# EasyEDA Pro project ProPrj_VacUBear_2026-03-05.epro

# Schematic Schematic1
Board Name: Board1; Create Date: 2026-03-03; Page Name: P1; Project Name: VacUBear; Schematic Name: Schematic1; Update Date: 2026-03-03; Company: EasyEDA.com; Page Size: A4; Version: V1.0
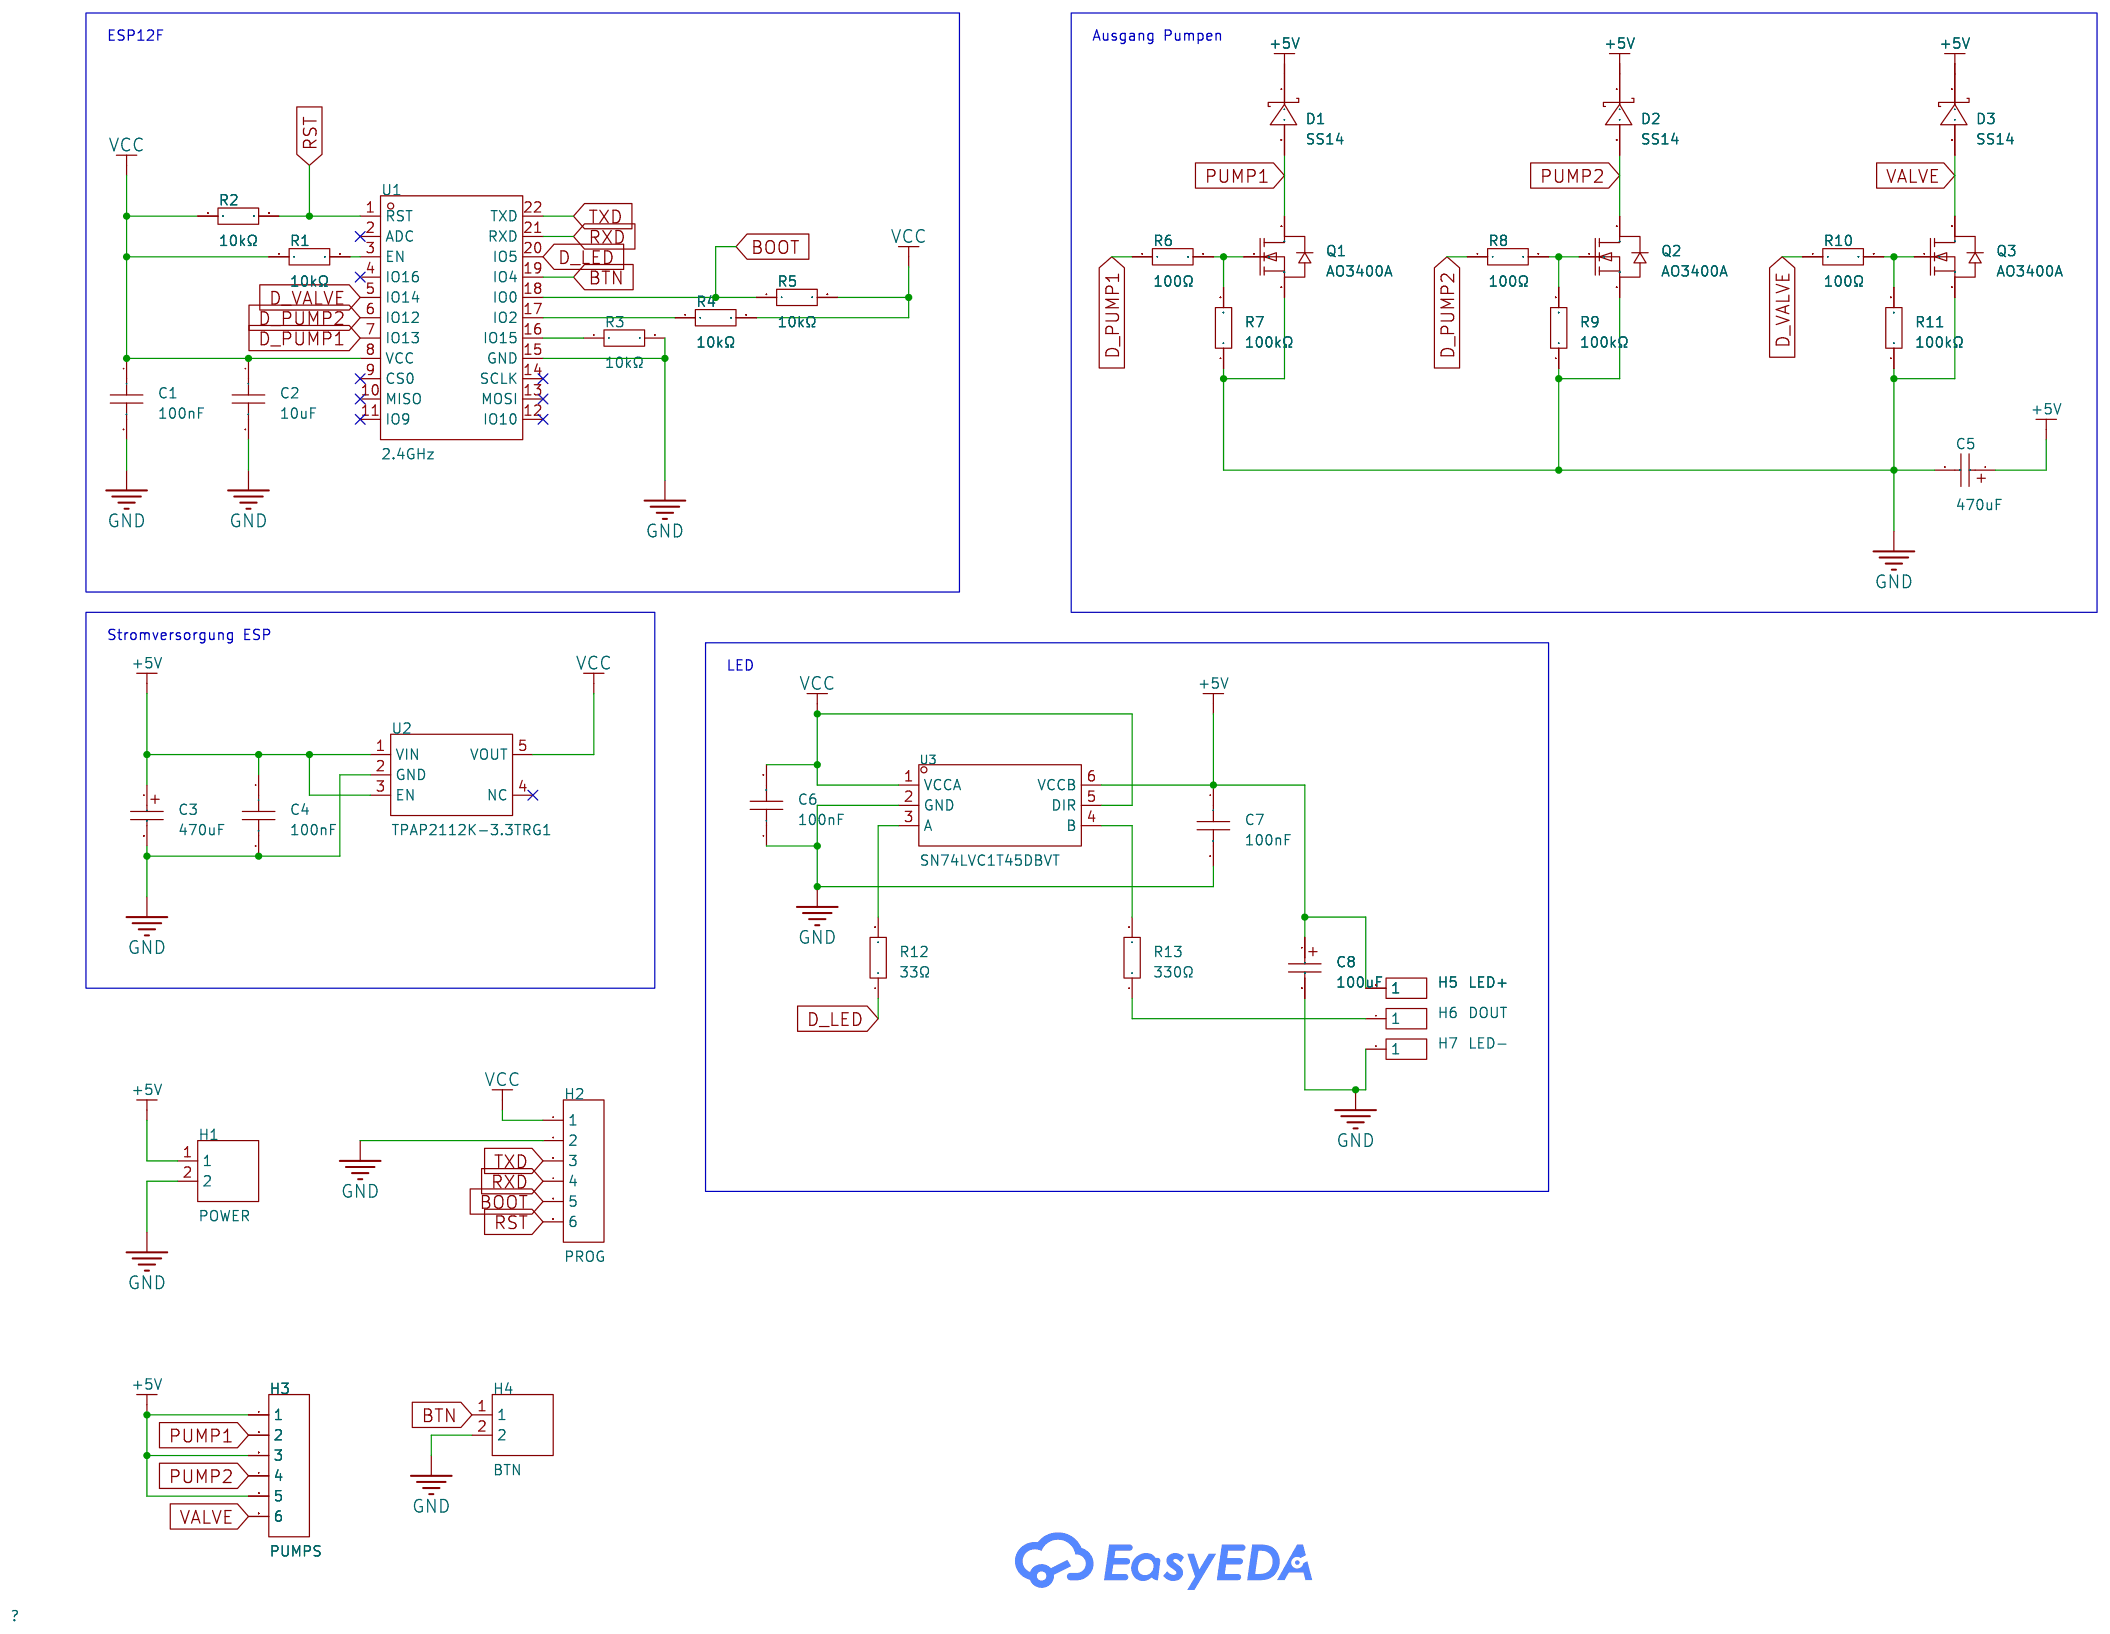
[diagram p0: schematic sheet]

## Parts
C1  100nF  [C0402]
C2  10uF  [C0603]
C3  470uF  [CAP-SMD_BD6.3-L6.6-W6.6-LS7.6-RD]
C4  100nF  [C0402]
C5  470uF  [CAP-SMD_BD6.3-L6.6-W6.6-LS7.6-RD]
C6  100nF  [C0402]
C7  100nF  [C0402]
C8  100uF  [CAP-SMD_BD6.3-L6.6-W6.6-LS7.2-FD]
D1  SS14  [SMA_L4.2-W2.6-LS5.0-RD_1]
D2  SS14  [SMA_L4.2-W2.6-LS5.0-RD_1]
D3  SS14  [SMA_L4.2-W2.6-LS5.0-RD_1]
H1  POWER  [HDR-TH_2P-P2.54-V-M-1]
H2  PROG  [PogoProgPad]
H3  PUMPS  [HDR-TH_6P-P2.54-V-M-1]
H4  BTN  [HDR-TH_2P-P2.54-V-M-1]
H5  LED+  [HDR-TH_1P-V-M_XKB_X4611WV-01I-C28D40]
H6  DOUT  [HDR-TH_1P-V-M_XKB_X4611WV-01I-C28D40]
H7  LED-  [HDR-TH_1P-V-M_XKB_X4611WV-01I-C28D40]
Q1  AO3400A  [SOT-23-3_L2.9-W1.3-P1.90-LS2.4-BR]
Q2  AO3400A  [SOT-23-3_L2.9-W1.3-P1.90-LS2.4-BR]
Q3  AO3400A  [SOT-23-3_L2.9-W1.3-P1.90-LS2.4-BR]
R1  10kΩ  [R0402]
R2  10kΩ  [R0402]
R3  10kΩ  [R0402]
R4  10kΩ  [R0402]
R5  10kΩ  [R0402]
R6  100Ω  [R0402]
R7  100kΩ  [R0402]
R8  100Ω  [R0402]
R9  100kΩ  [R0402]
R10  100Ω  [R0402]
R11  100kΩ  [R0402]
R12  33Ω  [R0402]
R13  330Ω  [R0402]
U1  2.4GHz  [WIRELM-SMD_ESP-12F]
U2  TPAP2112K-3.3TRG1  [SOT-23-5_L2.9-W1.6-P0.95-LS2.8-BR]
U3  SN74LVC1T45DBVT  [SOT-23-6_L2.9-W1.6-P0.95-LS2.8-BR]

## Library data of the parts
C1 C4 C6 C7 = CL05B104KB54PNC: Capacitance:100nF Tolerance:±10% Tolerance:±10% Voltage Rating:50V Temperature Coefficient:X7R; LCSC Part Name: 100nF ±10% 50V; Supplier Part: C307331; Manufacturer: SAMSUNG(三星); Supplier Footprint: 0402; JLCPCB Part Class: Basic Part; Datasheet: https://item.szlcsc.com/datasheet/CL05B104KB54PNC/291005.html; Supplier: LCSC; Tolerance: ±10%; Voltage Rating: 50V; Temperature Coefficient: X7R
C2 = CL10A106MQ8NNNC: Capacitance:10uF Tolerance:±20% Tolerance:±20% Voltage Rating:6.3V Temperature Coefficient:X5R; LCSC Part Name: 10uF ±20% 6.3V; Supplier Part: C1691; Manufacturer: SAMSUNG(三星); Supplier Footprint: 0603; JLCPCB Part Class: Extended Part; Datasheet: https://item.szlcsc.com/datasheet/CL10A106MQ8NNNC/2043.html; Supplier: LCSC; Tolerance: ±20%; Voltage Rating: 6.3V; Temperature Coefficient: X5R
C3 C5 = RVT1C471M0607: Capacitance:470uF Tolerance:±20% Tolerance:±20% Voltage Rating:16V Ripple Current:185mA@120Hz Diameter:6.3mm Height - Seated (Max):7.7mm Lifetime:2000hrs@105℃ Operating Temperature:-40℃~+105℃ Operating Temperature:-40℃~+105℃; LCSC Part Name: 470uF ±20% 16V; Supplier Part: C2977552; Manufacturer: ROQANG(容强); Supplier Footprint: SMD,D6.3xL7.7mm; JLCPCB Part Class: Extended Part; Supplier: LCSC; Tolerance: ±20%; Voltage Rating: 16V; Ripple Current: 185mA@120Hz; Diameter: 6.3mm; Height - Seated (Max): 7.7mm; Lifetime: 2000hrs@105℃; Operating Temperature: -40℃~+105℃
C8 = RVT100UF16V67RV0016: Capacitance:100uF Tolerance:±20% Tolerance:±20% Voltage Rating:16V Ripple Current:93mA@120Hz Equivalent Series Resistance(ESR):- Diameter:6.3mm Height - Seated (Max):5.4mm Lifetime:2000hrs@105℃ Operating Temperature:-55℃~+105℃ Operating Temperature:-55℃~+; LCSC Part Name: 100uF ±20% 16V; Supplier Part: C2887276; Manufacturer: KNSCHA(科尼盛); Supplier Footprint: SMD,D6.3xL5.4mm; JLCPCB Part Class: Extended Part; Datasheet: https://item.szlcsc.com/datasheet/RVT100UF16V67RV0016/3103844.html; Supplier: LCSC; Tolerance: ±20%; Voltage Rating: 16V; Ripple Current: 93mA@120Hz; Diameter: 6.3mm; Height - Seated (Max): 5.4mm; Lifetime: 2000hrs@105℃; Operating Temperature: -55℃~+105℃
D1-D3 = SS14_C2480: Diode Configuration:Independent Voltage - Forward(Vf@If):550mV@1A Voltage - DC Reverse(Vr):40V Current - Rectified:1A Reverse Leakage Current (Ir):300uA@40V Operating Junction Temperature Range:-55℃~+150℃ Operating Junction Temperature Range:-55℃~+150℃ No; LCSC Part Name: 电压:40V 电流:1A; Supplier Part: C2480; Manufacturer: MDD(辰达半导体); Supplier Footprint: SMA(DO-214AC); JLCPCB Part Class: Basic Part; Datasheet: https://item.szlcsc.com/datasheet/SS14/2857.html; Supplier: LCSC; Diode Configuration: Independent; Voltage - Forward(Vf@If): 550mV@1A; Voltage - DC Reverse(Vr): 40V; Current - Rectified: 1A; Reverse Leakage Current (Ir): 300uA@40V; Operating Junction Temperature Range: -55℃~+150℃; Non-Repetitive Peak Forward Surge Current: 25A
H1 H4 = HDR-M_2.54_1x2P: Supplier Footprint: Through; Check: false
H2 H3 = HDR-M_2.54_1x6P: Supplier Footprint: Through; Check: false
H5-H7 = HDR-M_2.54_1x1P: Supplier Footprint: Through; Check: false
Q1-Q3 = AO3400A: Number:1 N-Channel Drain to Source Voltage:30V Current - Continuous Drain(Id):5.2A RDS(on):27mΩ@4.5V,5A Pd - Power Dissipation:1W Gate Threshold Voltage (Vgs(th)):850mV Gate Charge(Qg):11.7nC@4.5V Input Capacitance(Ciss):927pF@15V Reverse Transfer Capacit; LCSC Part Name: N沟道,电流:5.2A,耐压:30V; Supplier Part: C700953; Manufacturer: HUASHUO(华朔); Supplier Footprint: SOT-23; JLCPCB Part Class: Extended Part; Datasheet: https://item.szlcsc.com/datasheet/AO3400A/736021.html; Supplier: LCSC; Number: 1 N-Channel; Drain to Source Voltage: 30V; Current - Continuous Drain(Id): 5.2A; RDS(on): 27mΩ@4.5V,5A; Pd - Power Dissipation: 1W; Gate Threshold Voltage (Vgs(th)): 850mV; Gate Charge(Qg): 11.7nC@4.5V; Input Capacitance(Ciss): 927pF@15V; Reverse Transfer Capacitance (Crss@Vds): 61pF@15V; Operating Temperature: -55℃~+150℃
R1-R5 = RC0402JR-0710KL: Type:Thick Film Resistors Resistance:10kΩ Tolerance:±5% Tolerance:±5% Power(Watts):62.5mW Voltage-Supply(Max):50V Temperature Coefficient:±100ppm/℃ Temperature Coefficient:±100ppm/℃ Operating Temperature:-55℃~+155℃ Operating Temperature:-55℃~+155℃; LCSC Part Name: 厚膜电阻 10kΩ ±5% 62.5mW; Supplier Part: C60489; Manufacturer: YAGEO(国巨); Supplier Footprint: 0402; JLCPCB Part Class: Extended Part; Datasheet: https://item.szlcsc.com/datasheet/RC0402JR-0710KL/61541.html; Supplier: LCSC; Type: Thick Film Resistors; Tolerance: ±5%; Power(Watts): 62.5mW; Voltage-Supply(Max): 50V; Temperature Coefficient: ±100ppm/℃; Operating Temperature: -55℃~+155℃
R6 R8 R10 = FRC0402F1000TS: Type:Thick Film Resistor Resistance:100Ω Tolerance:±1% Tolerance:±1% Power(Watts):62.5mW Voltage-Supply(Max):50V Temperature Coefficient:±100ppm/℃ Temperature Coefficient:±100ppm/℃ Operating Temperature:-55℃~+155℃ Operating Temperature:-55℃~+155℃; LCSC Part Name: 100Ω ±1% 62.5mW 厚膜电阻; Supplier Part: C2906860; Manufacturer: FOJAN(富捷); Supplier Footprint: 0402; JLCPCB Part Class: Extended Part; Supplier: LCSC; Type: Thick Film Resistor; Tolerance: ±1%; Power(Watts): 62.5mW; Voltage-Supply(Max): 50V; Temperature Coefficient: ±100ppm/℃; Operating Temperature: -55℃~+155℃
R7 R9 R11 = RC0402FR-07100KL: Type:Thick Film Resistor Resistance:100kΩ Tolerance:±1% Tolerance:±1% Power(Watts):62.5mW Voltage-Supply(Max):50V Temperature Coefficient:±100ppm/℃ Temperature Coefficient:±100ppm/℃ Operating Temperature:-55℃~+155℃ Operating Temperature:-55℃~+155℃; LCSC Part Name: 厚膜电阻 100kΩ ±1% 62.5mW; Supplier Part: C60491; Manufacturer: YAGEO(国巨); Supplier Footprint: 0402; JLCPCB Part Class: Extended Part; Datasheet: https://item.szlcsc.com/datasheet/RC0402FR-07100KL/61543.html; Supplier: LCSC; Type: Thick Film Resistor; Tolerance: ±1%; Power(Watts): 62.5mW; Voltage-Supply(Max): 50V; Temperature Coefficient: ±100ppm/℃; Operating Temperature: -55℃~+155℃
R12 = FRC0402F33R0TS: Type:Thick Film Resistor Resistance:33Ω Tolerance:±1% Tolerance:±1% Power(Watts):62.5mW Voltage-Supply(Max):50V Temperature Coefficient:±100ppm/℃ Temperature Coefficient:±100ppm/℃ Operating Temperature:-55℃~+155℃ Operating Temperature:-55℃~+155℃; LCSC Part Name: 33Ω ±1% 62.5mW 厚膜电阻; Supplier Part: C2906868; Manufacturer: FOJAN(富捷); Supplier Footprint: 0402; JLCPCB Part Class: Extended Part; Supplier: LCSC; Type: Thick Film Resistor; Tolerance: ±1%; Power(Watts): 62.5mW; Voltage-Supply(Max): 50V; Temperature Coefficient: ±100ppm/℃; Operating Temperature: -55℃~+155℃
R13 = FRC0402F3300TS: Type:Thick Film Resistor Resistance:330Ω Tolerance:±1% Tolerance:±1% Power(Watts):62.5mW Voltage-Supply(Max):50V Temperature Coefficient:±100ppm/℃ Temperature Coefficient:±100ppm/℃ Operating Temperature:-55℃~+155℃ Operating Temperature:-55℃~+155℃; LCSC Part Name: 330Ω ±1% 62.5mW 厚膜电阻; Supplier Part: C2930002; Manufacturer: FOJAN(富捷); Supplier Footprint: 0402; JLCPCB Part Class: Extended Part; Supplier: LCSC; Type: Thick Film Resistor; Tolerance: ±1%; Power(Watts): 62.5mW; Voltage-Supply(Max): 50V; Temperature Coefficient: ±100ppm/℃; Operating Temperature: -55℃~+155℃
U1 = ESP-12F: Utilized IC / Part:- Wireless Standard:WIFI4 Interface Type:UART Frequency:2.4GHz Antenna Type:PCB Output Power:15dBm Output Power:15dBm Voltage - Supply:3.3V Voltage - Supply:3.3V Receive  Current:55mA Send  Current:375mA Sensitivity:-96dBm Sensitivity:-; LCSC Part Name: ESP8266 WiFi模组,32Mbit Flash, 通用模组; Supplier Part: C19949064; Manufacturer: DOIT(四博智联); Supplier Footprint: SMD,24x16mm; JLCPCB Part Class: Extended Part; Datasheet: https://item.szlcsc.com/datasheet/ESP-12F/21278194.html; Supplier: LCSC; Wireless Standard: WIFI4; Interface Type: UART; Antenna Type: PCB; Output Power: 15dBm; Voltage - Supply: 3.3V; Receive  Current: 55mA; Send  Current: 375mA; Sensitivity: -96dBm; Operating Temperature: -40℃~+85℃
U2 = TPAP2112K-3.3TRG1: Output Type:Fixed Voltage - Supply:5.5V Output Voltage:3.3V Output Voltage:3.3V Output Current:600mA Power Supply Rejection Ratio (PSRR):80dB@(100Hz) Voltage Dropout:320mV@(600mA) standby current:10uA Features:Over Current Protection；Over Temperature Prot; LCSC Part Name: Higt PSRR Voltage Regulator; Supplier Part: C3021085; Manufacturer: TECH PUBLIC(台舟); Supplier Footprint: SOT-23-5; JLCPCB Part Class: Extended Part; Datasheet: https://item.szlcsc.com/datasheet/TPAP2112K-3.3TRG1/3544067.html; Supplier: LCSC; Output Type: Fixed; Voltage - Supply: 5.5V; Output Voltage: 3.3V; Output Current: 600mA; Power Supply Rejection Ratio (PSRR): 80dB@(100Hz); Voltage Dropout: 320mV@(600mA); standby current: 10uA; Features: Over Current Protection；Over Temperature Protection; Operating Temperature: -40℃~+85℃@(Ta); Output Configuration: Positive; Number of Outputs: 1
U3 = SN74LVC1T45DBVT: Channel Type:Bidirectional Data Rate:420Mbps Voltage - Supply(VCCA):1.65V~5.5V Voltage - Supply(VCCA):1.65V~5.5V Voltage - Supply(VCCB):1.65V~5.5V Voltage - Supply(VCCB):1.65V~5.5V Number of Circuits:1 Number of Circuits:1 Output Type:Tri-State Operating; Supplier Part: C116653; Manufacturer: TI(德州仪器); Supplier Footprint: SOT-23-6; JLCPCB Part Class: Extended Part; Datasheet: https://www.ti.com/cn/lit/gpn/sn74lvc1t45; Supplier: LCSC; Channel Type: Bidirectional; Data Rate: 420Mbps; Voltage - Supply(VCCA): 1.65V~5.5V; Voltage - Supply(VCCB): 1.65V~5.5V; Number of Circuits: 1; Output Type: Tri-State; Operating Temperature: -40℃~+85℃

## Nets
+5V: C3.1 C4.1 C5.1 C7.1 C8.1 D1.1(K) D2.1(K) D3.1(K) H1.1 H3.1 H3.3 H3.5 H5.1 U2.1(VIN) U2.3(EN) U3.6(VCCB)
GND: C1.2 C2.2 C3.2 C4.2 C5.2 C6.1 C7.2 C8.2 H1.2 H2.2 H4.2 H7.1 Q1.2(S) Q2.2(S) Q3.2(S) R3.2 R7.1 R9.1 R11.1 U1.15(GND) U2.2(GND) U3.2(GND)
VCC: C1.1 C2.1 C6.2 H2.1 R1.1 R2.1 R4.2 R5.2 U1.8(VCC) U2.5(VOUT) U3.1(VCCA) U3.5(DIR)
BOOT: H2.5 R5.1 U1.18(IO0)
BTN: H4.1 U1.19(IO4)
D_LED: R12.1 U1.20(IO5)
D_PUMP1: R6.1 U1.7(IO13)
D_PUMP2: R8.1 U1.6(IO12)
D_VALVE: R10.1 U1.5(IO14)
PUMP1: D1.2(A) H3.2 Q1.3(D)
PUMP2: D2.2(A) H3.4 Q2.3(D)
RST: H2.6 R2.2 U1.1(RST)
RXD: H2.4 U1.21(RXD)
TXD: H2.3 U1.22(TXD)
VALVE: D3.2(A) H3.6 Q3.3(D)
$1N1206: R1.2 U1.3(EN)
$1N1582: R3.1 U1.16(IO15)
$1N1692: R4.1 U1.17(IO2)
$1N2957: Q1.1(G) R6.2 R7.2
$1N3447: Q2.1(G) R8.2 R9.2
$1N3686: Q3.1(G) R10.2 R11.2
$1N4302: R12.2 U3.3(A)
$1N4307: R13.2 U3.4(B)
$1N4334: H6.1 R13.1

Not connected (* = marked no-connect by the designer): U1 2(ADC)* 4(IO16)* 9(CS0)* 10(MISO)* 11(IO9)* 12(IO10)* 13(MOSI)* 14(SCLK)*; U2 4(NC)*

## Notes on the sheet
- ESP12F
- Ausgang Pumpen
- Stromversorgung ESP
- LED

# Board PCB1
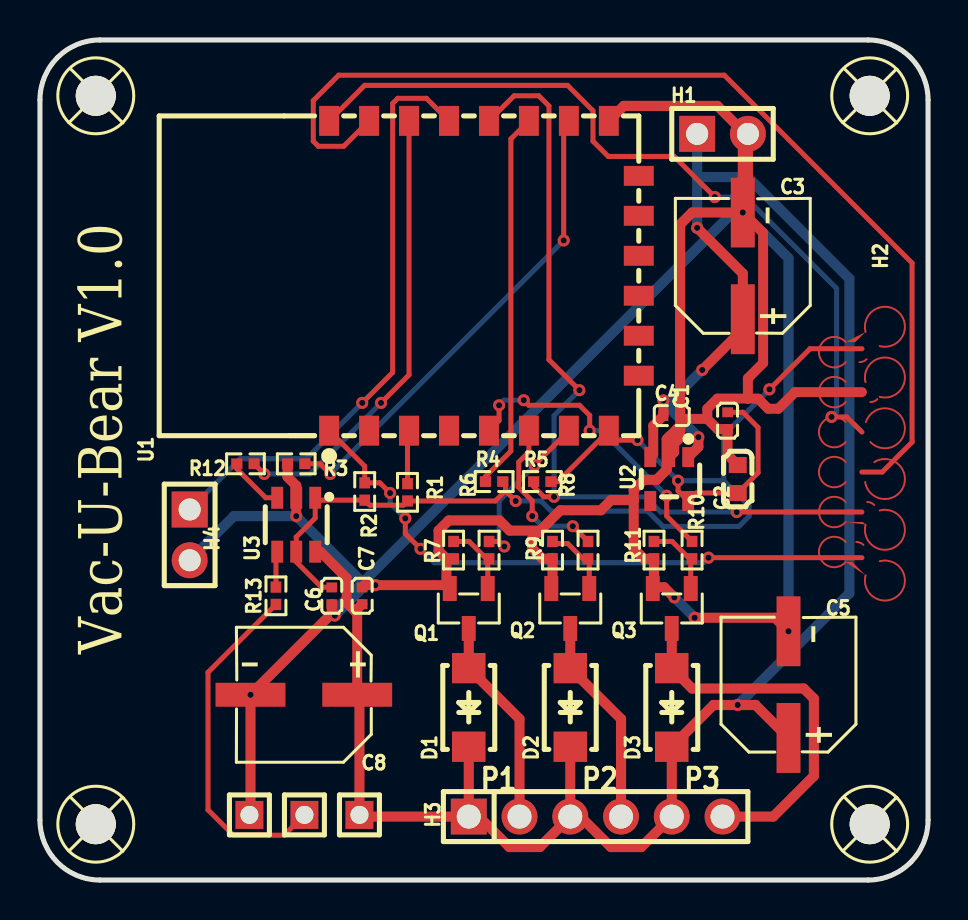
[diagram p1: board, top side]
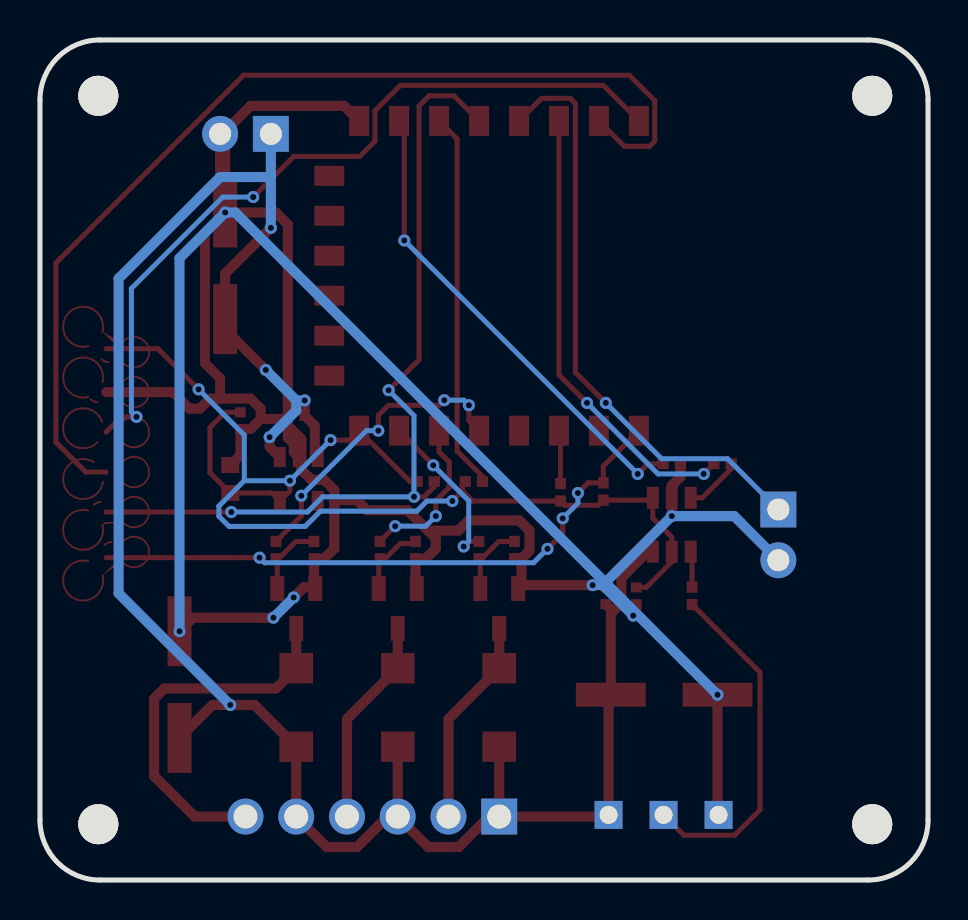
[diagram p2: board, bottom side, seen from below]

Outline 44.45 x 42.04 mm; copper layers: Top Layer, Bottom Layer. Coordinates in mm from the lower left corner of the outline.
Outline path: 0,39.04 0,3 arc(0.88,0.88) 3,0 41.45,0 arc(43.57,0.88) 44.45,3 44.45,39.04 arc(43.57,41.16) 41.45,42.04 3,42.04 arc(0.88,41.16) 0,39.04
Stack: Top Layer 0.035mm / Dielectric1 1.51mm FR4 er 4.5 / Bottom Layer 0.035mm

## Design rules (mm)
template: Custom Config
spacing copperThickness1oz (default): track to track 0.102, other pairs 0.152 to 0.3
spacing copperThickness2oz: track to track 0.203, other pairs 0.152 to 0.3
spacing DickeLeitung: track to track 0.152, other pairs 0.152 to 0.3
track width copperThickness1oz (default): min 0.127, default 0.254, max 2.54
track width copperThickness2oz: min 0.203, default 0.254, max 2.54
track width DickeLeitung: min 0.127, default 0.508, max 2.54
differential pair differentialPair (default): width min 0.127, default 0.254, max 2.54; gap min 0.152, default 0.152
via viaSize (default): diameter min 0.5, default 0.61, max 10; hole min 0.3, default 0.305, max 6.3
net GND uses DickeLeitung
net +5V uses DickeLeitung
net PUMP1 uses DickeLeitung
net PUMP2 uses DickeLeitung
net VALVE uses DickeLeitung

## Placement (name value [footprint] x y rotation side)
C1  100nF  [C0402]  34.42 22.99 270 top
C2  10uF  [C0603]  34.92 20.07 90 top
C3  470uF  [CAP-SMD_BD6.3-L6.6-W6.6-LS7.6-RD]  35.18 30.73 90 top
C4  100nF  [C0402]  31.62 23.24 0 top
C5  470uF  [CAP-SMD_BD6.3-L6.6-W6.6-LS7.6-RD]  37.47 9.78 90 top
C6  100nF  [C0402]  14.6 14.22 90 top
C7  100nF  [C0402]  16.13 14.22 90 top
C8  100uF  [CAP-SMD_BD6.3-L6.6-W6.6-LS7.2-FD]  13.21 9.27 180 top
D1  SS14  [SMA_L4.2-W2.6-LS5.0-RD_1]  21.46 8.64 90 top
D2  SS14  [SMA_L4.2-W2.6-LS5.0-RD_1]  26.54 8.64 90 top
D3  SS14  [SMA_L4.2-W2.6-LS5.0-RD_1]  31.62 8.64 90 top
H1  POWER  [HDR-TH_2P-P2.54-V-M-1]  34.16 37.34 0 top
H2  PROG  [PogoProgPad]  41.02 21.34 270 top
H3  PUMPS  [HDR-TH_6P-P2.54-V-M-1]  27.81 3.17 0 top
H4  BTN  [HDR-TH_2P-P2.54-V-M-1]  7.49 17.27 270 top
H5  LED+  [HDR-TH_1P-V-M_XKB_X4611WV-01I-C28D40]  15.99 3.26 0 top
H6  DOUT  [HDR-TH_1P-V-M_XKB_X4611WV-01I-C28D40]  13.24 3.26 0 top
H7  LED-  [HDR-TH_1P-V-M_XKB_X4611WV-01I-C28D40]  10.48 3.26 270 top
Q1  AO3400A  [SOT-23-3_L2.9-W1.3-P1.90-LS2.4-BR]  21.46 13.59 90 top
Q2  AO3400A  [SOT-23-3_L2.9-W1.3-P1.90-LS2.4-BR]  26.54 13.59 90 top
Q3  AO3400A  [SOT-23-3_L2.9-W1.3-P1.90-LS2.4-BR]  31.62 13.59 90 top
R1  10kΩ  [R0402]  18.4 19.4 90 top
R2  10kΩ  [R0402]  16.25 19.44 90 top
R3  10kΩ  [R0402]  12.83 20.83 180 top
R4  10kΩ  [R0402]  22.73 19.94 0 top
R5  10kΩ  [R0402]  25.15 19.94 0 top
R6  100Ω  [R0402]  22.48 16.51 270 top
R7  100kΩ  [R0402]  20.7 16.51 90 top
R8  100Ω  [R0402]  27.43 16.51 270 top
R9  100kΩ  [R0402]  25.65 16.51 90 top
R10  100Ω  [R0402]  32.64 16.51 270 top
R11  100kΩ  [R0402]  30.73 16.51 90 top
R12  33Ω  [R0402]  10.29 20.83 180 top
R13  330Ω  [R0402]  11.81 14.22 90 top
SCREW1  -  [Screw-Hole-M2]  2.79 39.24 0 top
SCREW2  -  [Screw-Hole-M2]  41.53 39.24 0 top
SCREW3  -  [Screw-Hole-M2]  41.53 2.79 0 top
SCREW4  -  [Screw-Hole-M2]  2.79 2.79 0 top
U1  2.4GHz  [WIRELM-SMD_ESP-12F]  22.22 30.24 90 top
U2  TPAP2112K-3.3TRG1  [SOT-23-5_L2.9-W1.6-P0.95-LS2.8-BR]  31.5 20.07 90 top
U3  SN74LVC1T45DBVT  [SOT-23-6_L2.9-W1.6-P0.95-LS2.8-BR]  12.83 17.78 90 top

## Footprints (pads in the part's own frame, mm; a bottom-side part is the same pattern mirrored in y, then rotated)
C0402
  rect 0.5x0.54 smd: 1(-0.42,0) 2(0.42,0)
C0603
  rect 0.8x0.9 smd: 1(-0.7,0) 2(0.7,0)
CAP-SMD_BD6.3-L6.6-W6.6-LS7.2-FD
  rect 3.5x1.2 smd: 1(-2.67,0) 2(2.67,0)
CAP-SMD_BD6.3-L6.6-W6.6-LS7.6-RD
  rect 3.5x1.2 smd: 1(-2.67,0) 2(2.67,0)
HDR-TH_1P-V-M_XKB_X4611WV-01I-C28D40
  rect 1.4x1.4 hole 0.9: 1(0,0)
HDR-TH_2P-P2.54-V-M-1
  rect 1.8x1.8 hole 1.1: 1(-1.27,0)
  round 1.8 hole 1.1: 2(1.27,0)
HDR-TH_6P-P2.54-V-M-1
  rect 1.8x1.8 hole 1.2: 1(-6.35,0)
  round 1.8 hole 1.2: 2(-3.81,0) 3(-1.27,0) 4(1.27,0) 5(3.81,0) 6(6.35,0)
PogoProgPad
  custom 3.032x4.302 smd: 1(-5.25,0.119)
  custom 2.492x4.302 smd: 2(-3.08,0.119)
  custom 2x4.302 smd: 3(-1.08,0.119)
  custom 2.112x4.302 smd: 4(0.92,0.119)
  custom 2.652x4.302 smd: 5(2.92,0.119)
  custom 3.192x4.302 smd: 6(5.205,0.119)
R0402
  rect 0.566x0.54 smd: 1(-0.433,0) 2(0.433,0)
Screw-Hole-M2
  round 2 hole 2: 1(0,0)
SMA_L4.2-W2.6-LS5.0-RD_1
  rect 1.52x1.68 smd: 1(-1.965,0) 2(1.965,0)
SOT-23-3_L2.9-W1.3-P1.90-LS2.4-BR
  rect 1.25x0.7 smd: 1(1,-0.95) 2(1,0.95) 3(-1,0)
SOT-23-5_L2.9-W1.6-P0.95-LS2.8-BR
  rect 1x0.6 smd: 1(1.1,-0.95) 2(1.1,0) 3(1.1,0.95) 4(-1.1,0.95) 5(-1.1,-0.95)
SOT-23-6_L2.9-W1.6-P0.95-LS2.8-BR
  rect 1.1x0.6 smd: 1(1.35,-0.95) 2(1.35,0) 3(1.35,0.95) 4(-1.35,0.95) 5(-1.35,0) 6(-1.35,-0.95)
WIRELM-SMD_ESP-12F
  rect 1.5x1 smd: 1(-7.75,7.75) 2(-7.75,5.75) 3(-7.75,3.75) 4(-7.75,1.75) 5(-7.75,-0.25) 6(-7.75,-2.25) 7(-7.75,-4.25) 8(-7.75,-6.25) 15(7.75,-6.25) 16(7.75,-4.25) 17(7.75,-2.25) 18(7.75,-0.25) 19(7.75,1.75) 20(7.75,3.75) 21(7.75,5.75) 22(7.75,7.75)
  rect 1x1.5 smd: 9(-5,-7.75) 10(-3,-7.75) 11(-1,-7.75) 12(1,-7.75) 13(3,-7.75) 14(5,-7.75)

## Nets
As in the schematic.

Pads without a net: SCREW1 1; SCREW2 1; SCREW3 1; SCREW4 1; U1 2 4 9 10 11 12 13 14; U2 4

## Via types
v1: diameter 0.61, hole 0.305, Top Layer to Bottom Layer, 39 vias

## Routing (per net, layer and track width the routed paths; a pad name or vN(x,y) marks a point on that pad's centre or on a via; arc(x,y) is an arc through that point)
+5V: length 107.6
  Top Layer w0.5: v1(33.15,25.52) 35.18,27.56 C3.1 ; 15.88,13.34 15.35,13.87 15.35,15.11 14.03,16.43 U3.6 ; 15.88,13.34 15.88,13.55 C7.1 ; 15.88,13.34 C8.1 ; v1(31.2,24) C4.1 30.69,22.73 30.69,21.31 U2.3
  Top Layer w0.508: 21.97,3.17 21.46,3.68 21.46,6.67 ; 21.97,3.17 H3.1 16.08,3.17 H5.1 15.99,9.16 C8.1 ; 21.97,3.17 23.5,1.65 25.02,1.65 26.54,3.17 27.05,3.17 ; 27.05,3.17 26.54,3.68 26.54,6.67 ; 27.05,3.17 28.57,1.65 30.1,1.65 H3.5 31.62,6.67 33.71,8.76 v1(34.92,8.76) 35.81,8.76 C5.1 ; v1(32.95,22.16) 32.95,21.67 U2.1 ; v1(32.89,32.64) 35.18,30.35 C3.1
  Bottom Layer w0.5: v1(33.15,25.52) 31.62,24 v1(31.2,24)
  Bottom Layer w0.508: 31.62,24 31.62,23.49 v1(32.95,22.16) ; 32.89,35.18 35.43,35.18 40.51,30.1 40.51,14.35 v1(34.92,8.76) ; 32.89,35.18 H1.1 ; 32.89,35.18 v1(32.89,32.64)
GND: length 182.2
  Top Layer w0.5: 32.04,23.24 32.21,23.08 32.38,23.08 ; 32.38,23.08 31.88,22.57 ; 32.38,23.08 33.4,23.08 ; v1(10.54,9.27) 14.6,13.34 14.6,13.39 ; v1(14.76,13.23) 14.6,13.39 ; 14.6,13.39 C6.1 ; v1(12.83,18.21) 12.83,18.72 ; 31.5,22.19 U2.2 ; 35.43,24.09 35.43,25.11 36.19,25.87 36.19,32.39 v1(35.18,33.4) ; 35.43,24.09 35.94,24.09 36.45,23.58 36.96,23.58 37.79,24.42 H2.2 ; 35.43,24.09 33.91,24.09 33.4,23.58 33.4,23.08 ; 20.35,14.76 v1(16.79,14.76) 16.24,14.76 C7.2 ; 33.4,23.08 33.91,22.57 34.42,22.57 34.42,21.27 C2.2
  Top Layer w0.508: 30.73,14.65 Q3.2 ; 30.73,14.65 R11.1 30.23,16.08 29.72,16.59 29.72,19.01 ; 30.73,14.65 31.24,14.65 v1(31.75,14.14) ; H7.1 10.54,3.31 v1(10.54,9.27) ; 35.43,37.21 35.43,33.66 v1(35.18,33.4) ; 35.43,37.21 H1.2 ; 35.43,37.21 35.18,36.96 v1(35.18,33.4) ; 35.43,37.21 33.91,38.74 29.22,38.74 U1.15 ; v1(35.18,33.4) 32.64,33.4 32.04,32.81 32.04,22.14 31.74,21.83 31.74,21.41 U2.2 ; v1(32.77,13.13) 36.79,13.13 v1(37.47,12.45) ; 20.35,16.08 R7.1 ; 20.35,16.08 20.35,14.76 Q1.2 ; 20.35,16.08 19.95,16.47 19.95,17.49 20.46,18 23,18 23.51,17.49 25.03,17.49 ; 25.03,17.49 26.05,18.5 28.08,18.5 28.59,19.01 29.72,19.01 ; 25.03,17.49 24.64,17.09 24.64,16.59 25.15,16.08 R9.1 25.65,14.65 25.59,14.59 ; 29.72,19.01 29.72,19.52 30.23,20.03 30.86,20.03 31.37,20.53 31.37,22.06 31.88,22.57 ; 12.83,18.72 U3.2 12.83,19.73 12.39,20.17 R3.2
  Bottom Layer w0.5: 16.28,14.76 v1(12.83,18.21) ; 16.28,14.76 v1(14.76,13.23) ; 16.28,14.76 v1(16.79,14.76)
  Bottom Layer w0.508: v1(31.75,14.14) v1(32.77,13.13) ; v1(10.54,9.27) 34.67,33.4 v1(35.18,33.4) 37.47,31.12 v1(37.47,12.45) ; v1(12.83,18.21) 9.7,18.21 H4.2
VCC: length 63
  Top Layer w0.254: 23.3,19.47 22.8,18.97 R1.1 18.18,18.76 16.51,18.76 16.25,19.01 13.9,19.01 U3.1 13.78,18.11 12.83,17.16 U3.5 12.83,15.92 14.1,14.65 14.6,14.65 C6.2 ; 23.3,19.47 23.3,19.8 R4.2 ; 23.3,19.47 v1(23.81,18.97) ; v1(29.91,22.01) 28.95,22.01 U1.8 25.92,19.94 25.58,19.94 ; v1(36.51,24.55) 38.54,26.59 H2.1 ; v1(31.94,19.98) 31.94,19.47 U2.5 32.85,19.37 C2.1 35.94,20.38 35.94,22.64 35.18,23.41 C1.1
  Bottom Layer w0.254: v1(36.51,24.55) 34.22,22.27 34.22,19.98 ; 34.22,19.98 v1(31.94,19.98) v1(29.91,22.01) ; 34.22,19.98 35.49,18.71 35.49,18.2 34.99,17.7 31.18,17.7 30.41,18.46 25.59,18.46 25.08,18.97 v1(23.81,18.97)
BOOT: length 41.7
  Top Layer w0.254: v1(34.87,18.42) H2.5 ; v1(25.73,19.18) 25.22,19.18 24.71,19.69 R5.1 ; U1.18 23.73,39.24 24.97,39.24 25.47,38.73 25.47,26.03 v1(27,24.51)
  Bottom Layer w0.254: v1(27,24.51) 25.73,23.24 v1(25.73,19.18) 30.3,19.18 31.06,18.42 v1(34.87,18.42)
BTN: length 29.9
  Top Layer w0.254: v1(16.13,23.88) 17.65,25.4 17.65,38.86 17.91,39.12 19.34,39.12 U1.19
  Bottom Layer w0.254: H4.1 10.03,21.08 13.34,21.08 v1(16.13,23.88)
D_LED: length 22.7
  Top Layer w0.254: U1.20 18.47,25.28 v1(17.07,23.88) ; R12.1 v1(11.23,20.32)
  Bottom Layer w0.254: v1(11.23,20.32) 13.51,20.32 v1(17.07,23.88)
D_PUMP1: length 8.2
  Top Layer w0.254: v1(24.76,20.75) 24.76,20.78 U1.7 ; v1(23.24,16.69) 22.99,16.94 R6.1
  Bottom Layer w0.254: v1(23.24,16.69) 22.99,16.94 22.99,18.97 v1(24.76,20.75)
D_PUMP2: length 8.1
  Top Layer w0.254: U1.6 24.47,21.43 23.96,20.92 23.96,19.65 24.64,18.97 v1(24.64,18.21) ; R8.1 v1(26.67,17.7)
  Bottom Layer w0.254: v1(26.67,17.7) 25.15,17.7 v1(24.64,18.21)
D_VALVE: length 15.2
  Top Layer w0.254: v1(24.21,24.01) 24.47,23.76 27.01,23.76 27.52,23.25 v1(27.52,22.49) ; R10.1 31.37,18.21 v1(31.37,19.23) ; v1(22.98,23.76) 22.98,23 U1.5
  Bottom Layer w0.254: v1(22.98,23.76) 23.23,24.01 v1(24.21,24.01) ; v1(31.37,19.23) 28.11,22.49 v1(27.52,22.49)
PUMP1: length 10.5
  Top Layer w0.508: Q1.3 D1.2 24,8.06 H3.2
PUMP2: length 10.5
  Top Layer w0.508: Q2.3 D2.2 29.08,8.06 H3.4
RST: length 30.7
  Top Layer w0.254: U1.1 16.25,20.71 R2.2 17.02,19.88 v1(17.52,19.37) ; v1(33.46,16.13) H2.6 ; v1(18.29,18.1) 18.29,17.34 v1(19.05,16.57)
  Bottom Layer w0.254: v1(17.52,19.37) 17.52,18.86 v1(18.29,18.1) ; v1(19.05,16.57) 19.74,15.88 33.21,15.88 v1(33.46,16.13)
RXD: length 51.9
  Top Layer w0.254: H2.4 42.16,20.42 43.65,21.91 43.65,30.88 34.25,40.27 14.95,40.27 13.68,39 13.68,36.97 13.93,36.72 15.2,36.72 U1.21
TXD: length 39.6
  Top Layer w0.254: U1.22 16.25,39.77 26.41,39.77 27.68,38.5 27.68,36.97 28.44,36.21 31.75,36.21 v1(33.78,34.18) ; H2.3 40.38,23.17 v1(39.62,23.17)
  Bottom Layer w0.254: v1(33.78,34.18) 35.3,34.18 39.87,29.61 39.87,23.43 v1(39.62,23.17)
VALVE: length 19
  Top Layer w0.508: Q3.3 D3.2 32.64,9.59 38.23,9.59 38.73,9.08 38.73,5.21 36.7,3.17 H3.6
$1N1206: length 2.7
  Top Layer w0.254: R1.2 18.4,22.41 U1.3
$1N1582: length 24.1
  Top Layer w0.254: v1(26.21,32) 26.21,37.73 U1.16 ; v1(14.53,20.32) 14.02,20.83 R3.1
  Bottom Layer w0.254: v1(14.53,20.32) v1(26.21,32)
$1N1692: length 18.9
  Top Layer w0.254: U1.17 23.57,37.08 23.57,21.46 22.3,20.19 R4.1
$1N2957: length 3.6
  Top Layer w0.254: 22.41,16.01 R6.2 ; 22.41,16.01 21.48,16.94 R7.2 ; 22.41,16.01 Q1.1
$1N3447: length 3.7
  Top Layer w0.254: Q2.1 27.49,16.02 R8.2 27.18,16.08 26.42,16.84 25.76,16.84 R9.2
$1N3686: length 3.7
  Top Layer w0.254: Q3.1 32.57,16.01 ; 32.57,16.01 R10.2 ; 32.57,16.01 31.64,16.94 R11.2
$1N4302: length 2.9
  Top Layer w0.254: U3.3 11.3,19.13 9.85,20.57 R12.2
$1N4307: length 1.8
  Top Layer w0.254: U3.4 11.81,16.36 11.81,14.66
$1N4334: length 17.5
  Top Layer w0.254: R13.1 8.41,10.39 8.41,3.51 9.68,2.24 12.22,2.24 H6.1

## Text on the board
Top Silkscreen Layer: P1 | P2 | P3 | Vac-U-Bear V1.0
